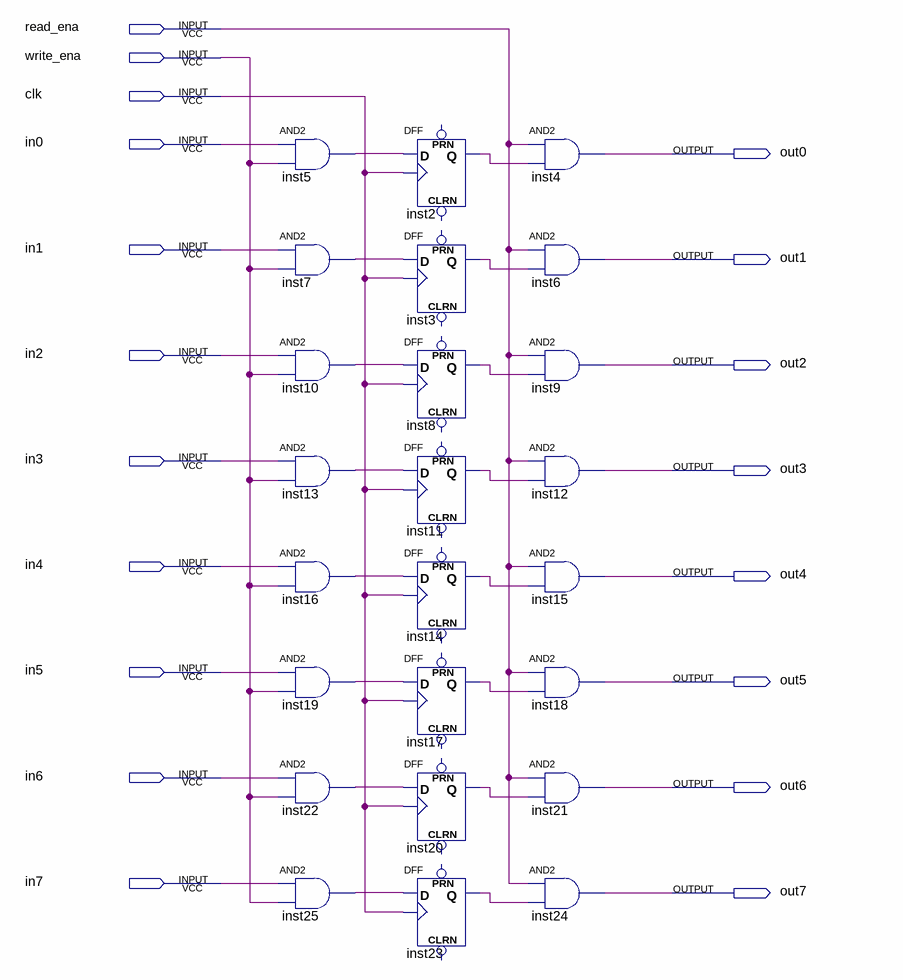
[diagram p0: schematic sheet]
// Quartus schematic register32.bdf as structural Verilog: 24 symbols, 19 pins
module register32 (
  input  read_ena,
  input  write_ena,
  input  clk,
  input  in0,
  input  in1,
  input  in2,
  input  in3,
  input  in4,
  input  in5,
  input  in6,
  input  in7,
  output out0,
  output out1,
  output out2,
  output out3,
  output out4,
  output out5,
  output out6,
  output out7
);

  wire inst2_q, inst3_q, inst5_out, inst7_out, inst8_q, inst10_out, inst11_q, inst13_out, inst14_q,
       inst16_out, inst17_q, inst19_out, inst20_q, inst22_out, inst23_q, inst25_out;

  and inst5 (inst5_out, in0, write_ena);
  and inst7 (inst7_out, in1, write_ena);
  and inst10 (inst10_out, in2, write_ena);
  and inst13 (inst13_out, in3, write_ena);
  and inst16 (inst16_out, in4, write_ena);
  and inst19 (inst19_out, in5, write_ena);
  and inst22 (inst22_out, in6, write_ena);
  and inst25 (inst25_out, in7, write_ena);
  DFF inst2 (.CLK(clk), .D(inst5_out), .Q(inst2_q));  // open: CLRN, PRN
  DFF inst3 (.CLK(clk), .D(inst7_out), .Q(inst3_q));  // open: CLRN, PRN
  DFF inst8 (.CLK(clk), .D(inst10_out), .Q(inst8_q));  // open: CLRN, PRN
  DFF inst11 (.CLK(clk), .D(inst13_out), .Q(inst11_q));  // open: CLRN, PRN
  DFF inst14 (.CLK(clk), .D(inst16_out), .Q(inst14_q));  // open: CLRN, PRN
  DFF inst17 (.CLK(clk), .D(inst19_out), .Q(inst17_q));  // open: CLRN, PRN
  DFF inst20 (.CLK(clk), .D(inst22_out), .Q(inst20_q));  // open: CLRN, PRN
  DFF inst23 (.CLK(clk), .D(inst25_out), .Q(inst23_q));  // open: CLRN, PRN
  and inst4 (out0, read_ena, inst2_q);
  and inst6 (out1, read_ena, inst3_q);
  and inst9 (out2, read_ena, inst8_q);
  and inst12 (out3, read_ena, inst11_q);
  and inst15 (out4, read_ena, inst14_q);
  and inst18 (out5, read_ena, inst17_q);
  and inst21 (out6, read_ena, inst20_q);
  and inst24 (out7, read_ena, inst23_q);
endmodule
